# Altium schematic sheet SCH_HDMI_GPIO.SchDoc: HDMI CM4
size 508 x 304 mm
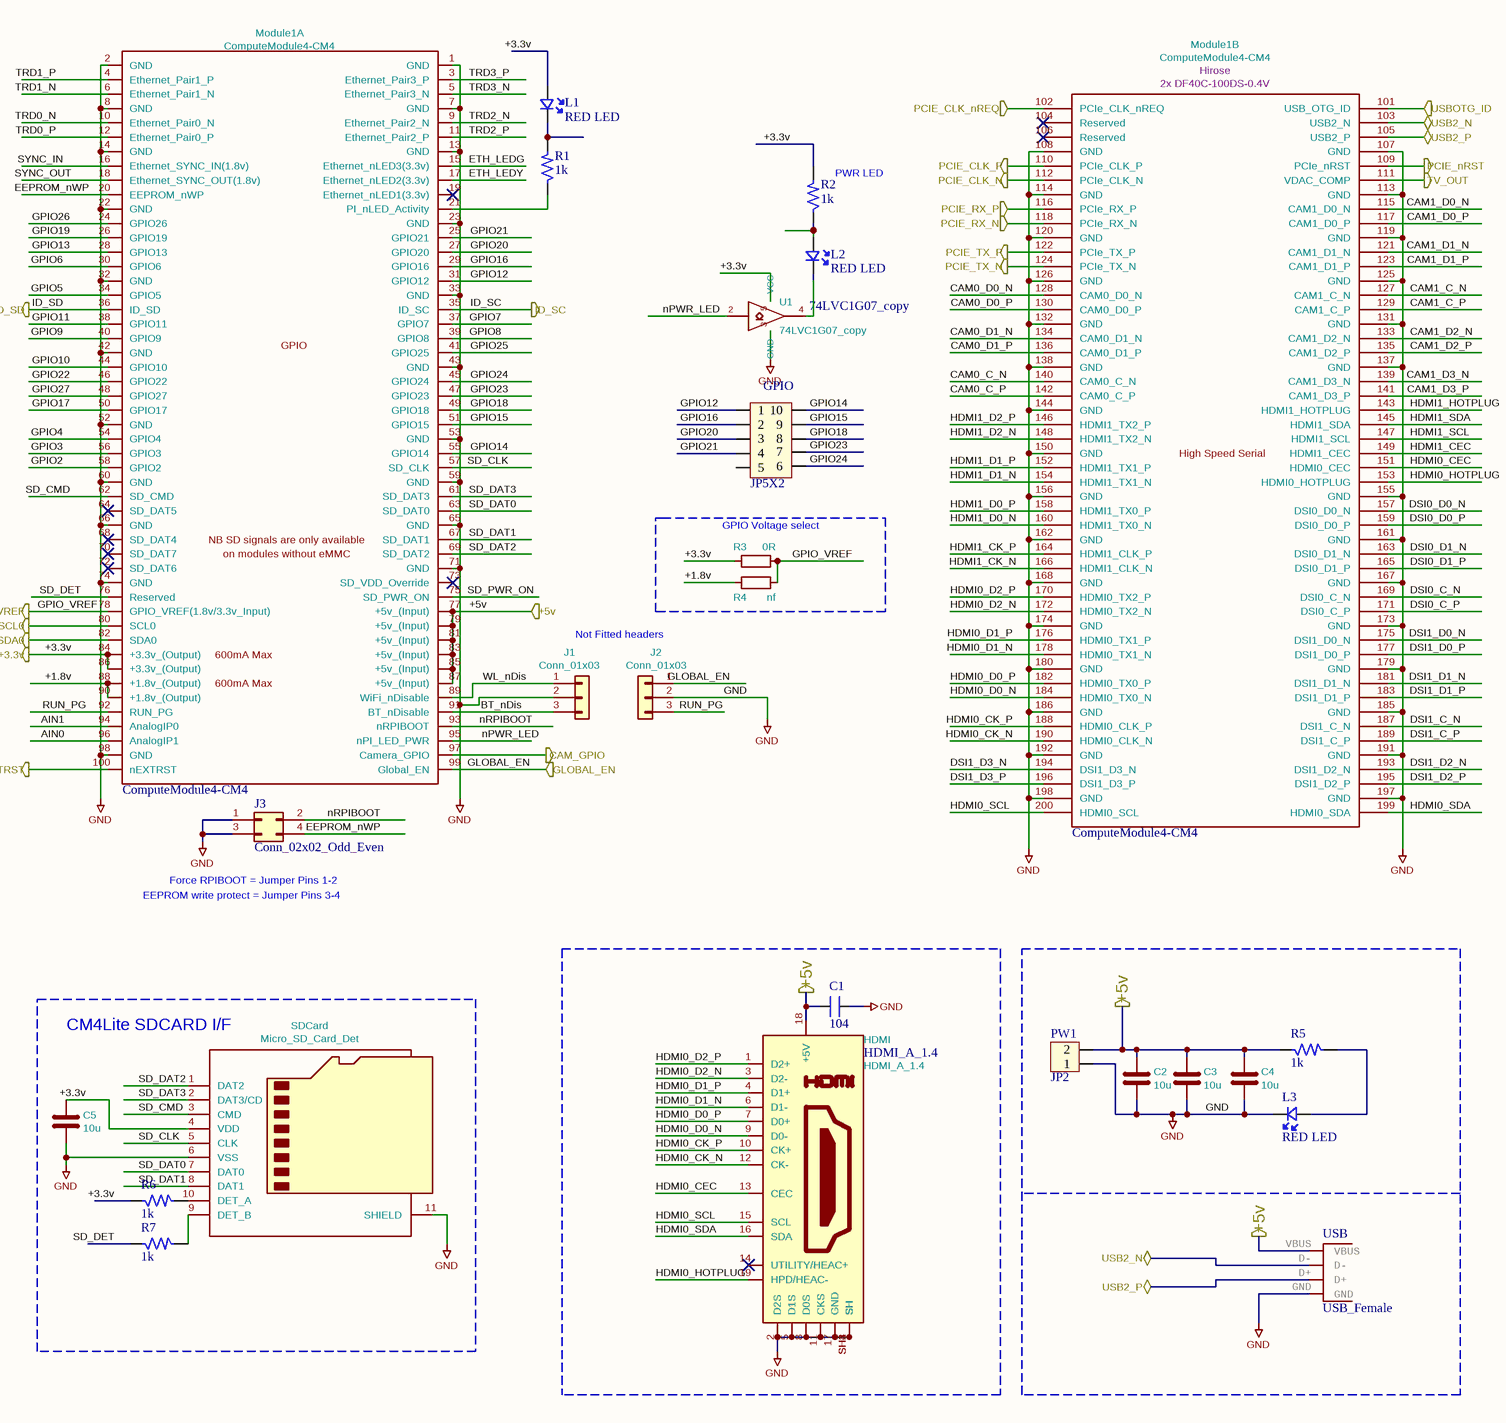
[diagram p0: SCH_HDMI_GPIO.SchDoc]

## Parts
C1  104  [SM-CAP-0805]
C2  10u  [C_0805_2012Metric]
C3  10u  [C_0805_2012Metric]
C4  10u  [C_0805_2012Metric]
C5  10u  [C_0805_2012Metric]
GPIO  JP5X2  [JP5X2]
HDMI  HDMI_A_1.4  [HDMI]
J1  Conn_01x03  [PinHeader_1x03_P2.54mm_Vertical]
J2  Conn_01x03  [PinHeader_1x03_P2.54mm_Vertical]
J3  Conn_02x02_Odd_Even  [CON2x2]
L1  RED LED  [LED_0805]
L2  RED LED  [LED_0805]
L3  RED LED  [LED_0805]
Module1  ComputeModule4-CM4  [Raspberry-Pi-4-Compute-Module]  (parts A,B of 2)
PW1  JP2  [CON2]
R1  1k  [SM-RES-1206]
R2  1k  [SM-RES-1206]
R3  0R  [R_0805_2012Metric_Pad1.15x1.40mm_HandSolder]
R4  nf  [R_0805_2012Metric_Pad1.15x1.40mm_HandSolder]
R5  1k  [SM-RES-1206]
R6  1k  [SM-RES-1206]
R7  1k  [SM-RES-1206]
SDCard  Micro_SD_Card_Det  [SDCARD_MOLEX_503398-1892]
U1  74LVC1G07_copy  [SOT-353_SC-70-5]
USB  USB_Female  [USB_Female]

## Blocks framed on the sheet
CM4Lite SDCARD I/F: C5 R6 R7 SDCard

## Ports
+3.3v (out), +5v (in), +5v (out), CAM_GPIO (out), GLOBAL_EN (in), GPIO_VREF (out), ID_SC (out), ID_SD (out), nEXTRST (out), PCIE_CLK_N (out), PCIE_CLK_nREQ (in), PCIE_CLK_P (out), PCIE_nRST (out), PCIE_RX_N (in), PCIE_RX_P (in), PCIE_TX_N (out), PCIE_TX_P (out), SCL0 (out), SDA0 (out), TV_OUT (out), USB2_N (bidir), USB2_P (bidir), USBOTG_ID (in)

## Nets
GND: C1.2 C2.2 C3.2 C4.2 C5.2 HDMI.2(D2S) HDMI.5(D1S) HDMI.8(D0S) HDMI.11(CKS) HDMI.17(GND) HDMI.SH1(SH) HDMI.SH2(SH) HDMI.SH3(SH) HDMI.SH4(SH) J1.2(Pin_2) J2.2(Pin_2) J3.1(Pin_1) J3.3(Pin_3) L3.K Module1.1(GND) Module1.2(GND) Module1.7(GND) Module1.8(GND) Module1.13(GND) Module1.14(GND) Module1.22(GND) Module1.23(GND) Module1.32(GND) Module1.33(GND) Module1.42(GND) Module1.43(GND) Module1.52(GND) Module1.53(GND) Module1.59(GND) Module1.60(GND) Module1.65(GND) Module1.66(GND) Module1.71(GND) Module1.74(GND) Module1.98(GND) Module1.107(GND) Module1.108(GND) Module1.113(GND) Module1.114(GND) Module1.119(GND) Module1.120(GND) Module1.125(GND) Module1.126(GND) Module1.131(GND) Module1.132(GND) Module1.137(GND) Module1.138(GND) Module1.144(GND) Module1.150(GND) Module1.155(GND) Module1.156(GND) Module1.161(GND) Module1.162(GND) Module1.167(GND) Module1.168(GND) Module1.173(GND) Module1.174(GND) Module1.179(GND) Module1.180(GND) Module1.185(GND) Module1.186(GND) Module1.191(GND) Module1.192(GND) Module1.197(GND) Module1.198(GND) PW1.1 SDCard.6(VSS) SDCard.11(SHIELD) U1.3(GND) USB.GND
+1.8v: Module1.88(+1.8v_(Output)) Module1.90(+1.8v_(Output)) R4.1
+3.3v: C5.1 L1.A Module1.84(+3.3v_(Output)) Module1.86(+3.3v_(Output)) R2.2 R3.1 R6.1 SDCard.4(VDD) U1.5(VCC) ; port +3.3v
+5v: C1.1 C2.1 C3.1 C4.1 HDMI.18(+5V) Module1.77(+5v_(Input)) Module1.79(+5v_(Input)) Module1.81(+5v_(Input)) Module1.83(+5v_(Input)) Module1.85(+5v_(Input)) Module1.87(+5v_(Input)) PW1.2 R5.1 USB.VBUS ; port +5v
AIN0: Module1.96(AnalogIP1)
AIN1: Module1.94(AnalogIP0)
BT_nDis: J1.3(Pin_3) Module1.91(BT_nDisable)
CAM0_C_N: Module1.140(CAM0_C_N)
CAM0_C_P: Module1.142(CAM0_C_P)
CAM0_D0_N: Module1.128(CAM0_D0_N)
CAM0_D0_P: Module1.130(CAM0_D0_P)
CAM0_D1_N: Module1.134(CAM0_D1_N)
CAM0_D1_P: Module1.136(CAM0_D1_P)
CAM1_C_N: Module1.127(CAM1_C_N)
CAM1_C_P: Module1.129(CAM1_C_P)
CAM1_D0_N: Module1.115(CAM1_D0_N)
CAM1_D0_P: Module1.117(CAM1_D0_P)
CAM1_D1_N: Module1.121(CAM1_D1_N)
CAM1_D1_P: Module1.123(CAM1_D1_P)
CAM1_D2_N: Module1.133(CAM1_D2_N)
CAM1_D2_P: Module1.135(CAM1_D2_P)
CAM1_D3_N: Module1.139(CAM1_D3_N)
CAM1_D3_P: Module1.141(CAM1_D3_P)
CAM_GPIO: Module1.97(Camera_GPIO) ; port CAM_GPIO
DSI0_C_N: Module1.169(DSI0_C_N)
DSI0_C_P: Module1.171(DSI0_C_P)
DSI0_D0_N: Module1.157(DSI0_D0_N)
DSI0_D0_P: Module1.159(DSI0_D0_P)
DSI0_D1_N: Module1.163(DSI0_D1_N)
DSI0_D1_P: Module1.165(DSI0_D1_P)
DSI1_C_N: Module1.187(DSI1_C_N)
DSI1_C_P: Module1.189(DSI1_C_P)
DSI1_D0_N: Module1.175(DSI1_D0_N)
DSI1_D0_P: Module1.177(DSI1_D0_P)
DSI1_D1_N: Module1.181(DSI1_D1_N)
DSI1_D1_P: Module1.183(DSI1_D1_P)
DSI1_D2_N: Module1.193(DSI1_D2_N)
DSI1_D2_P: Module1.195(DSI1_D2_P)
DSI1_D3_N: Module1.194(DSI1_D3_N)
DSI1_D3_P: Module1.196(DSI1_D3_P)
EEPROM_nWP: J3.4(Pin_4) Module1.20(EEPROM_nWP)
ETH_LEDG: Module1.15(Ethernet_nLED3(3.3v))
ETH_LEDY: Module1.17(Ethernet_nLED2(3.3v))
GLOBAL_EN: J2.1(Pin_1) Module1.99(Global_EN) ; port GLOBAL_EN
GPIO2: Module1.58(GPIO2)
GPIO3: Module1.56(GPIO3)
GPIO4: Module1.54(GPIO4)
GPIO5: Module1.34(GPIO5)
GPIO6: Module1.30(GPIO6)
GPIO7: Module1.37(GPIO7)
GPIO8: Module1.39(GPIO8)
GPIO9: Module1.40(GPIO9)
GPIO10: Module1.44(GPIO10)
GPIO11: Module1.38(GPIO11)
GPIO12: GPIO.1 Module1.31(GPIO12)
GPIO13: Module1.28(GPIO13)
GPIO14: GPIO.10 Module1.55(GPIO14)
GPIO15: GPIO.9 Module1.51(GPIO15)
GPIO16: GPIO.2 Module1.29(GPIO16)
GPIO17: Module1.50(GPIO17)
GPIO18: GPIO.8 Module1.49(GPIO18)
GPIO19: Module1.26(GPIO19)
GPIO20: GPIO.3 Module1.27(GPIO20)
GPIO21: GPIO.4 Module1.25(GPIO21)
GPIO22: Module1.46(GPIO22)
GPIO23: GPIO.7 Module1.47(GPIO23)
GPIO24: GPIO.6 Module1.45(GPIO24)
GPIO25: Module1.41(GPIO25)
GPIO26: Module1.24(GPIO26)
GPIO27: Module1.48(GPIO27)
GPIO_VREF: Module1.78(GPIO_VREF(1.8v/3.3v_Input)) R3.2 R4.2 ; port GPIO_VREF
HDMI0_CEC: HDMI.13(CEC) Module1.151(HDMI0_CEC)
HDMI0_CK_N: HDMI.12(CK-) Module1.190(HDMI0_CLK_N)
HDMI0_CK_P: HDMI.10(CK+) Module1.188(HDMI0_CLK_P)
HDMI0_D0_N: HDMI.9(D0-) Module1.184(HDMI0_TX0_N)
HDMI0_D0_P: HDMI.7(D0+) Module1.182(HDMI0_TX0_P)
HDMI0_D1_N: HDMI.6(D1-) Module1.178(HDMI0_TX1_N)
HDMI0_D1_P: HDMI.4(D1+) Module1.176(HDMI0_TX1_P)
HDMI0_D2_N: HDMI.3(D2-) Module1.172(HDMI0_TX2_N)
HDMI0_D2_P: HDMI.1(D2+) Module1.170(HDMI0_TX2_P)
HDMI0_HOTPLUG: HDMI.19(HPD/HEAC-) Module1.153(HDMI0_HOTPLUG)
HDMI0_SCL: HDMI.15(SCL) Module1.200(HDMI0_SCL)
HDMI0_SDA: HDMI.16(SDA) Module1.199(HDMI0_SDA)
HDMI1_CEC: Module1.149(HDMI1_CEC)
HDMI1_CK_N: Module1.166(HDMI1_CLK_N)
HDMI1_CK_P: Module1.164(HDMI1_CLK_P)
HDMI1_D0_N: Module1.160(HDMI1_TX0_N)
HDMI1_D0_P: Module1.158(HDMI1_TX0_P)
HDMI1_D1_N: Module1.154(HDMI1_TX1_N)
HDMI1_D1_P: Module1.152(HDMI1_TX1_P)
HDMI1_D2_N: Module1.148(HDMI1_TX2_N)
HDMI1_D2_P: Module1.146(HDMI1_TX2_P)
HDMI1_HOTPLUG: Module1.143(HDMI1_HOTPLUG)
HDMI1_SCL: Module1.147(HDMI1_SCL)
HDMI1_SDA: Module1.145(HDMI1_SDA)
ID_SC: Module1.35(ID_SC) ; port ID_SC
ID_SD: Module1.36(ID_SD) ; port ID_SD
nEXTRST: Module1.100(nEXTRST) ; port nEXTRST
nPWR_LED: Module1.95(nPI_LED_PWR) U1.2
nRPIBOOT: J3.2(Pin_2) Module1.93(nRPIBOOT)
PCIE_CLK_N: Module1.112(PCIe_CLK_N) ; port PCIE_CLK_N
PCIE_CLK_nREQ: Module1.102(PCIe_CLK_nREQ) ; port PCIE_CLK_nREQ
PCIE_CLK_P: Module1.110(PCIe_CLK_P) ; port PCIE_CLK_P
PCIE_nRST: Module1.109(PCIe_nRST) ; port PCIE_nRST
PCIE_RX_N: Module1.118(PCIe_RX_N) ; port PCIE_RX_N
PCIE_RX_P: Module1.116(PCIe_RX_P) ; port PCIE_RX_P
PCIE_TX_N: Module1.124(PCIe_TX_N) ; port PCIE_TX_N
PCIE_TX_P: Module1.122(PCIe_TX_P) ; port PCIE_TX_P
RUN_PG: J2.3(Pin_3) Module1.92(RUN_PG)
SCL0: Module1.80(SCL0) ; port SCL0
SD_CLK: Module1.57(SD_CLK) SDCard.5(CLK)
SD_CMD: Module1.62(SD_CMD) SDCard.3(CMD)
SD_DAT0: Module1.63(SD_DAT0) SDCard.7(DAT0)
SD_DAT1: Module1.67(SD_DAT1) SDCard.8(DAT1)
SD_DAT2: Module1.69(SD_DAT2) SDCard.1(DAT2)
SD_DAT3: Module1.61(SD_DAT3) SDCard.2(DAT3/CD)
SD_DET: Module1.76(Reserved) R7.1
SD_PWR_ON: Module1.75(SD_PWR_ON)
SDA0: Module1.82(SDA0) ; port SDA0
SYNC_IN: Module1.16(Ethernet_SYNC_IN(1.8v))
SYNC_OUT: Module1.18(Ethernet_SYNC_OUT(1.8v))
TRD0_N: Module1.10(Ethernet_Pair0_N)
TRD0_P: Module1.12(Ethernet_Pair0_P)
TRD1_N: Module1.6(Ethernet_Pair1_N)
TRD1_P: Module1.4(Ethernet_Pair1_P)
TRD2_N: Module1.9(Ethernet_Pair2_N)
TRD2_P: Module1.11(Ethernet_Pair2_P)
TRD3_N: Module1.5(Ethernet_Pair3_N)
TRD3_P: Module1.3(Ethernet_Pair3_P)
TV_OUT: Module1.111(VDAC_COMP) ; port TV_OUT
USB2_N: Module1.103(USB2_N) USB.D- ; port USB2_N
USB2_P: Module1.105(USB2_P) USB.D+ ; port USB2_P
USBOTG_ID: Module1.101(USB_OTG_ID) ; port USBOTG_ID
WL_nDis: J1.1(Pin_1) Module1.89(WiFi_nDisable)
NetL1_K: L1.K R1.2
NetL2_A: L2.A R2.1
NetL2_K: L2.K U1.4
NetL3_A: L3.A R5.2
NetModule1_21: Module1.21(PI_nLED_Activity) R1.1
NetR6_2: R6.2 SDCard.10(DET_A)
NetR7_2: R7.2 SDCard.9(DET_B)

Not connected (* = marked no-connect by the designer): GPIO 5; HDMI 14(UTILITY/HEAC+)*; Module1 19(Ethernet_nLED1(3.3v))* 64(SD_DAT5)* 68(SD_DAT4)* 70(SD_DAT7)* 72(SD_DAT6)* 73(SD_VDD_Override)* 104(Reserved)* 106(Reserved)*

## Notes on the sheet
- (near R2) PWR LED
- GPIO Voltage select
- Not Fitted headers
- Force RPIBOOT = Jumper Pins 1-2
- EEPROM write protect = Jumper Pins 3-4
- (in symbol ComputeModule4-CM4, part A) GPIO; NB SD signals are only available; on modules without eMMC; 600mA Max
- (in symbol ComputeModule4-CM4, part B) High Speed Serial

## Library data of the parts
C1 = CN: Value: 0,1uF/300V; Designed by: VanDungEvn
C2-C5 = C: Part Description: 10uF 10% 10V Ceramic Capacitor X7R 0805 (2012 Metric); Field5: 490-14381-1-ND; Field4: Digikey; Field6: GRM21BR71A106KA73L; Field7: Murata; Field8: 111893011; Value: 10u; Footprint: Capacitor_SMD:C_0805_2012Metric
HDMI = HDMI_A_1.4: ki_keywords: hdmi conn; ki_description: HDMI 1.4+ type A connector; ki_fp_filters: HDMI*A*; Value: HDMI_A_1.4; Supplier: https://en.wikipedia.org/wiki/HDMI
J1 J2 = Conn_01x03: Part Description: 3pin 0.1" connector; Field4: nf; Field5: nf; Field6: nf; Field7: nf; Value: Conn_01x03; Footprint: Connector_PinHeader_2.54mm:PinHeader_1x03_P2.54mm_Vertical
L1-L3 = LED-RED_10mA-0805: Red 621nm LED Indication - Discrete 2V 0805 (2012 Metric); Manufacturer: Lite-On Inc.; Manufacturer Part Number: LTST-C170EKT; Case/ Package: 0805; Supplier-1: Digikey; Supplier Part Number-1: 160-1178-1-ND
Module1 = ComputeModule4-CM4: Field4: Hirose; Field5: 2x DF40C-100DS-0.4V; Value: ComputeModule4-CM4; Footprint: CM4IO:Raspberry-Pi-4-Compute-Module
PW1 = Con2: Connector 2; Value: Connector 2
R1 R2 R5-R7 = R: Resistor 1/4W; Value: R1/4W - 1K
R3 = R: Part Description: Resistor 0R M2012 5%; Field4: Farnell; Field5: 9233750; Field7: Rohm; Field6: MCR10EZPJ000; Field8: 121629591; Value: 0R; Footprint: Resistor_SMD:R_0805_2012Metric_Pad1.15x1.40mm_HandSolder
R4 = R: Field4: nf; Field5: nf; Field6: nf; Value: nf; Footprint: Resistor_SMD:R_0805_2012Metric_Pad1.15x1.40mm_HandSolder
SDCard = Micro_SD_Card_Det: Part Description: 9 (8 + 1) Position Card Connector microSD™ Surface Mount, Right Angle Gold; Field4: Farnell; Field5: 2358234; Field6: 503398-1892; Field7: Molex; Field8: UCON00512; Value: Micro_SD_Card_Det; Footprint: CM4IO:SDCARD_MOLEX_503398-1892
U1 = 74LVC1G07_copy: ki_keywords: Single Gate Buff LVC CMOS Open Drain; ki_description: Single Buffer Gate w/ Open Drain, Low-Voltage CMOS; ki_fp_filters: SOT*\nSG-*; Value: 74LVC1G07_copy; Footprint: Package_TO_SOT_SMD:SOT-353_SC-70-5; Supplier: http://www.ti.com/lit/sg/scyt129e/scyt129e.pdf